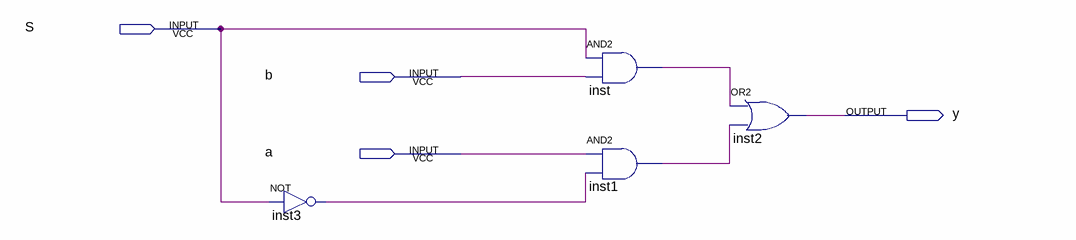
[diagram p0: schematic sheet]
// Quartus schematic Mux2_1.bdf as structural Verilog: 4 symbols, 4 pins
module Mux2_1 (
  input  S,
  input  b,
  input  a,
  output y
);

  wire inst1_out, inst3_out, inst_out;

  not inst3 (inst3_out, S);
  and inst (inst_out, S, b);
  and inst1 (inst1_out, a, inst3_out);
  or inst2 (y, inst_out, inst1_out);
endmodule
